# EAGLE design FLASHER (EAGLE 8.2.2)
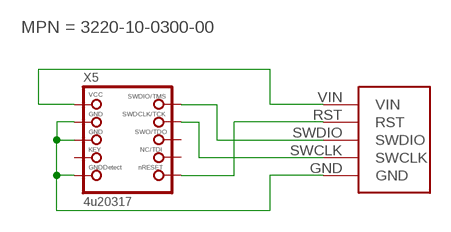
[diagram p0: schematic, sheet 1]

## Parts
U$1  SPRING_LOADED_HEADER  [SPRING_LOADED_HEADER]
X5  4u20317  JTAG-CORTEXBOXPOSTS  [2X05_1.27MM_BOX_POSTS]

## Nets
N$2: U$1.RST X5.10(NRESET)
N$3: U$1.SWDIO X5.2(SWDIO)
N$4: U$1.SWCLK X5.4(SWDCLK)
N$5: U$1.GND X5.3(GND) X5.5(GND) X5.9(GNDDETECT)
N$6: U$1.VIN X5.1(VCC)
Unconnected: X5.6(SWO) X5.7(KEY) X5.8(TDI)

## Library data of the parts
U$1 = FLASHER:SPRING_LOADED_HEADER
X5 = microbuilder:JTAG-CORTEX: Serial Wire (SW-DP) Connector Standard 0.05" 10-pin connector is for use with the Cortex M and Cortex A SWD (serial wire debugger) interface (SW-DP) Connectors 2x05_1.27MM_SMT - Inexpensive surface-mount header with bare pins, compatible with standard 10-pin SWD cables (4UCON: 16846) 2x05_1.27MM_BOX_NOPOSTS - Polarised surface-mount box (4UCON with caps: 19735, without caps: 15117 2x05_1.27MM_BOX_POSTS - Polarised surface-mount box with mounting holes (4UCON: 20317) Pinout: http://infocenter.arm.com/help/topic/com.arm.doc.faqs/attached/13634/cortex_debug_connectors.pdf http://www.keil.com/peripherals/coresight/connectors.asp; MPN: 3220-10-0300-00

## Board
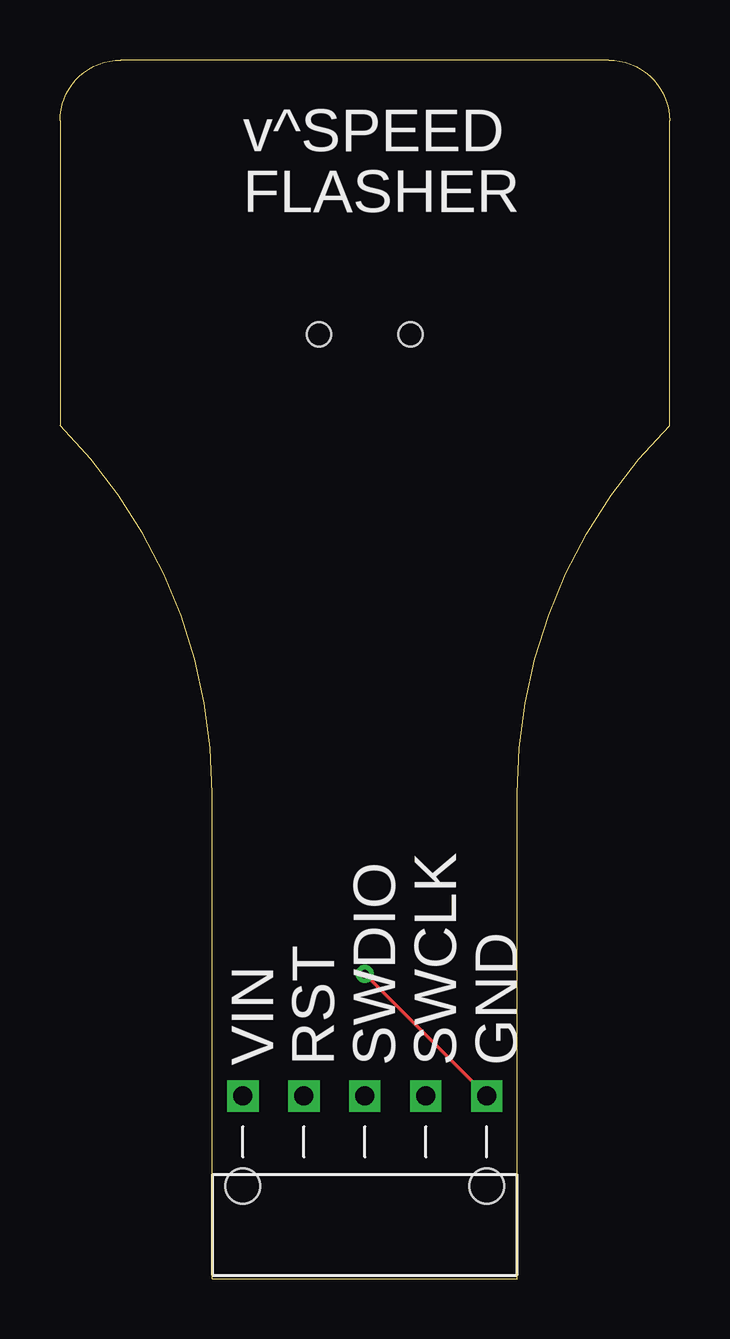
[diagram p1: board, top side]
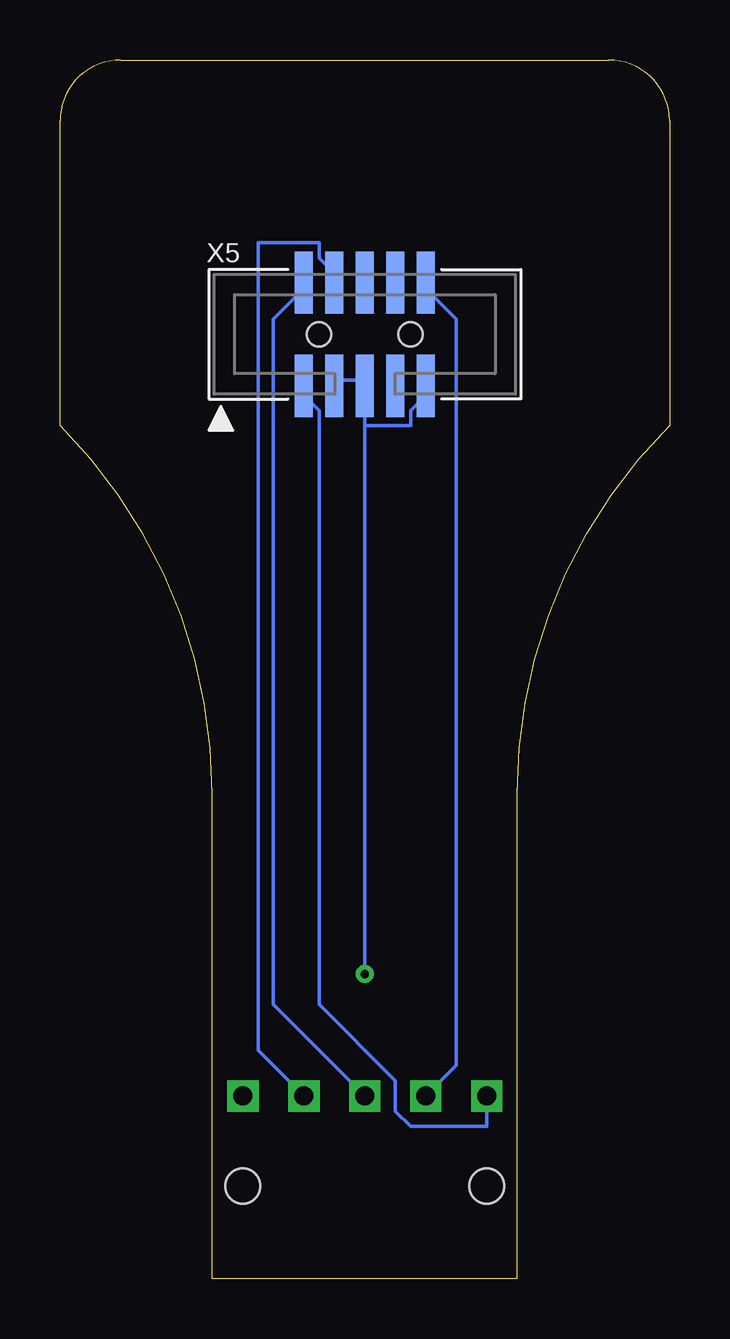
[diagram p2: board, bottom side, seen from below]

Size 25.4 x 50.8 mm. Coordinates in mm from the lower left corner, seen from the top.
Outline: 6.35,0 19.05,0 19.05,20.23 arc-45 25.4,35.56 25.4,48.26 arc90 22.86,50.8 2.54,50.8 arc90 0,48.26 0,35.56 arc-45 6.35,20.23 6.35,0
Copper layers (1*16): Top 0.035mm / dielectric 1.5mm / Bottom 0.035mm
Design rules "default": minimum track width 6mil, minimum drill 0.35mm, track to track 6mil, track to pad 6mil, pad to pad 6mil, via to via 6mil, smd to smd 6mil, copper to edge 40mil, drill to drill 6mil, minimum pad ring 10mil, minimum via ring 8mil, stop-mask expansion 4mil, vias tented up to drill 0mil, thermal gap 10mil

### Footprints (pad centres in the part's own frame; a part is rotated, then mirrored left to right if it is on the bottom)
SPRING_LOADED_HEADER = drill 0.8 square: GND 10.16,0; RST 2.54,0; SWCLK 7.62,0; SWDIO 5.08,0; VIN 0,0 | hole 1.45: 0,-3.76; 10.16,-3.76
2X05_1.27MM_BOX_POSTS = smd 0.76 x 2.6: 1 -2.54,-2.15; 2 -2.54,2.15; 3 -1.27,-2.15; 4 -1.27,2.15; 5 0,-2.15; 6 0,2.15; 7 1.27,-2.15; 8 1.27,2.15; 9 2.54,-2.15; 10 2.54,2.15 | hole 1: -1.905,0; 1.905,0

### Placement (x,y rotation side)
U$1  7.62,7.62 0 top
X5  12.7,39.37 0 bottom

### Tracks (layer width: path | path; a pad name or v marks a point on that pad's centre or on a via)
N$2
  Bottom 0.152: U$1.RST 8.89,8.89 8.89,40.01 10.16,41.27 X5.10
N$3
  Bottom 0.152: U$1.SWDIO 16.51,11.43 16.51,40.01 15.24,41.27 X5.2
N$4
  Bottom 0.152: U$1.SWCLK 17.14,9.53 17.14,43.18 14.61,43.18 14.61,42.55 13.97,41.91 X5.4
N$5  (via drill 0.35)
  Top 0.152: v12.7,12.7 U$1.GND
  Bottom 0.152: 12.7,35.56 10.79,35.56 10.79,36.2 10.16,36.83 X5.9 | 12.7,35.56 X5.5 12.7,37.47 13.97,37.47 X5.3 | 12.7,35.56 v12.7,12.7
N$6
  Bottom 0.152: U$1.VIN 7.62,6.35 10.79,6.35 11.43,6.99 11.43,8.26 14.61,11.43 14.61,36.2 15.24,36.83 X5.1

### Text on the board
tPlace: v^SPEED | FLASHER | VIN | RST | SWDIO | SWCLK | GND